# EasyEDA schematic SCH_krunchcard_2025-07-19.json
TITLE: Sheet_1; REV: 1.0; Date: 2024-11-27; Sheet: 1/1; Drawn By: krunchiekrunch; Company: Your Company
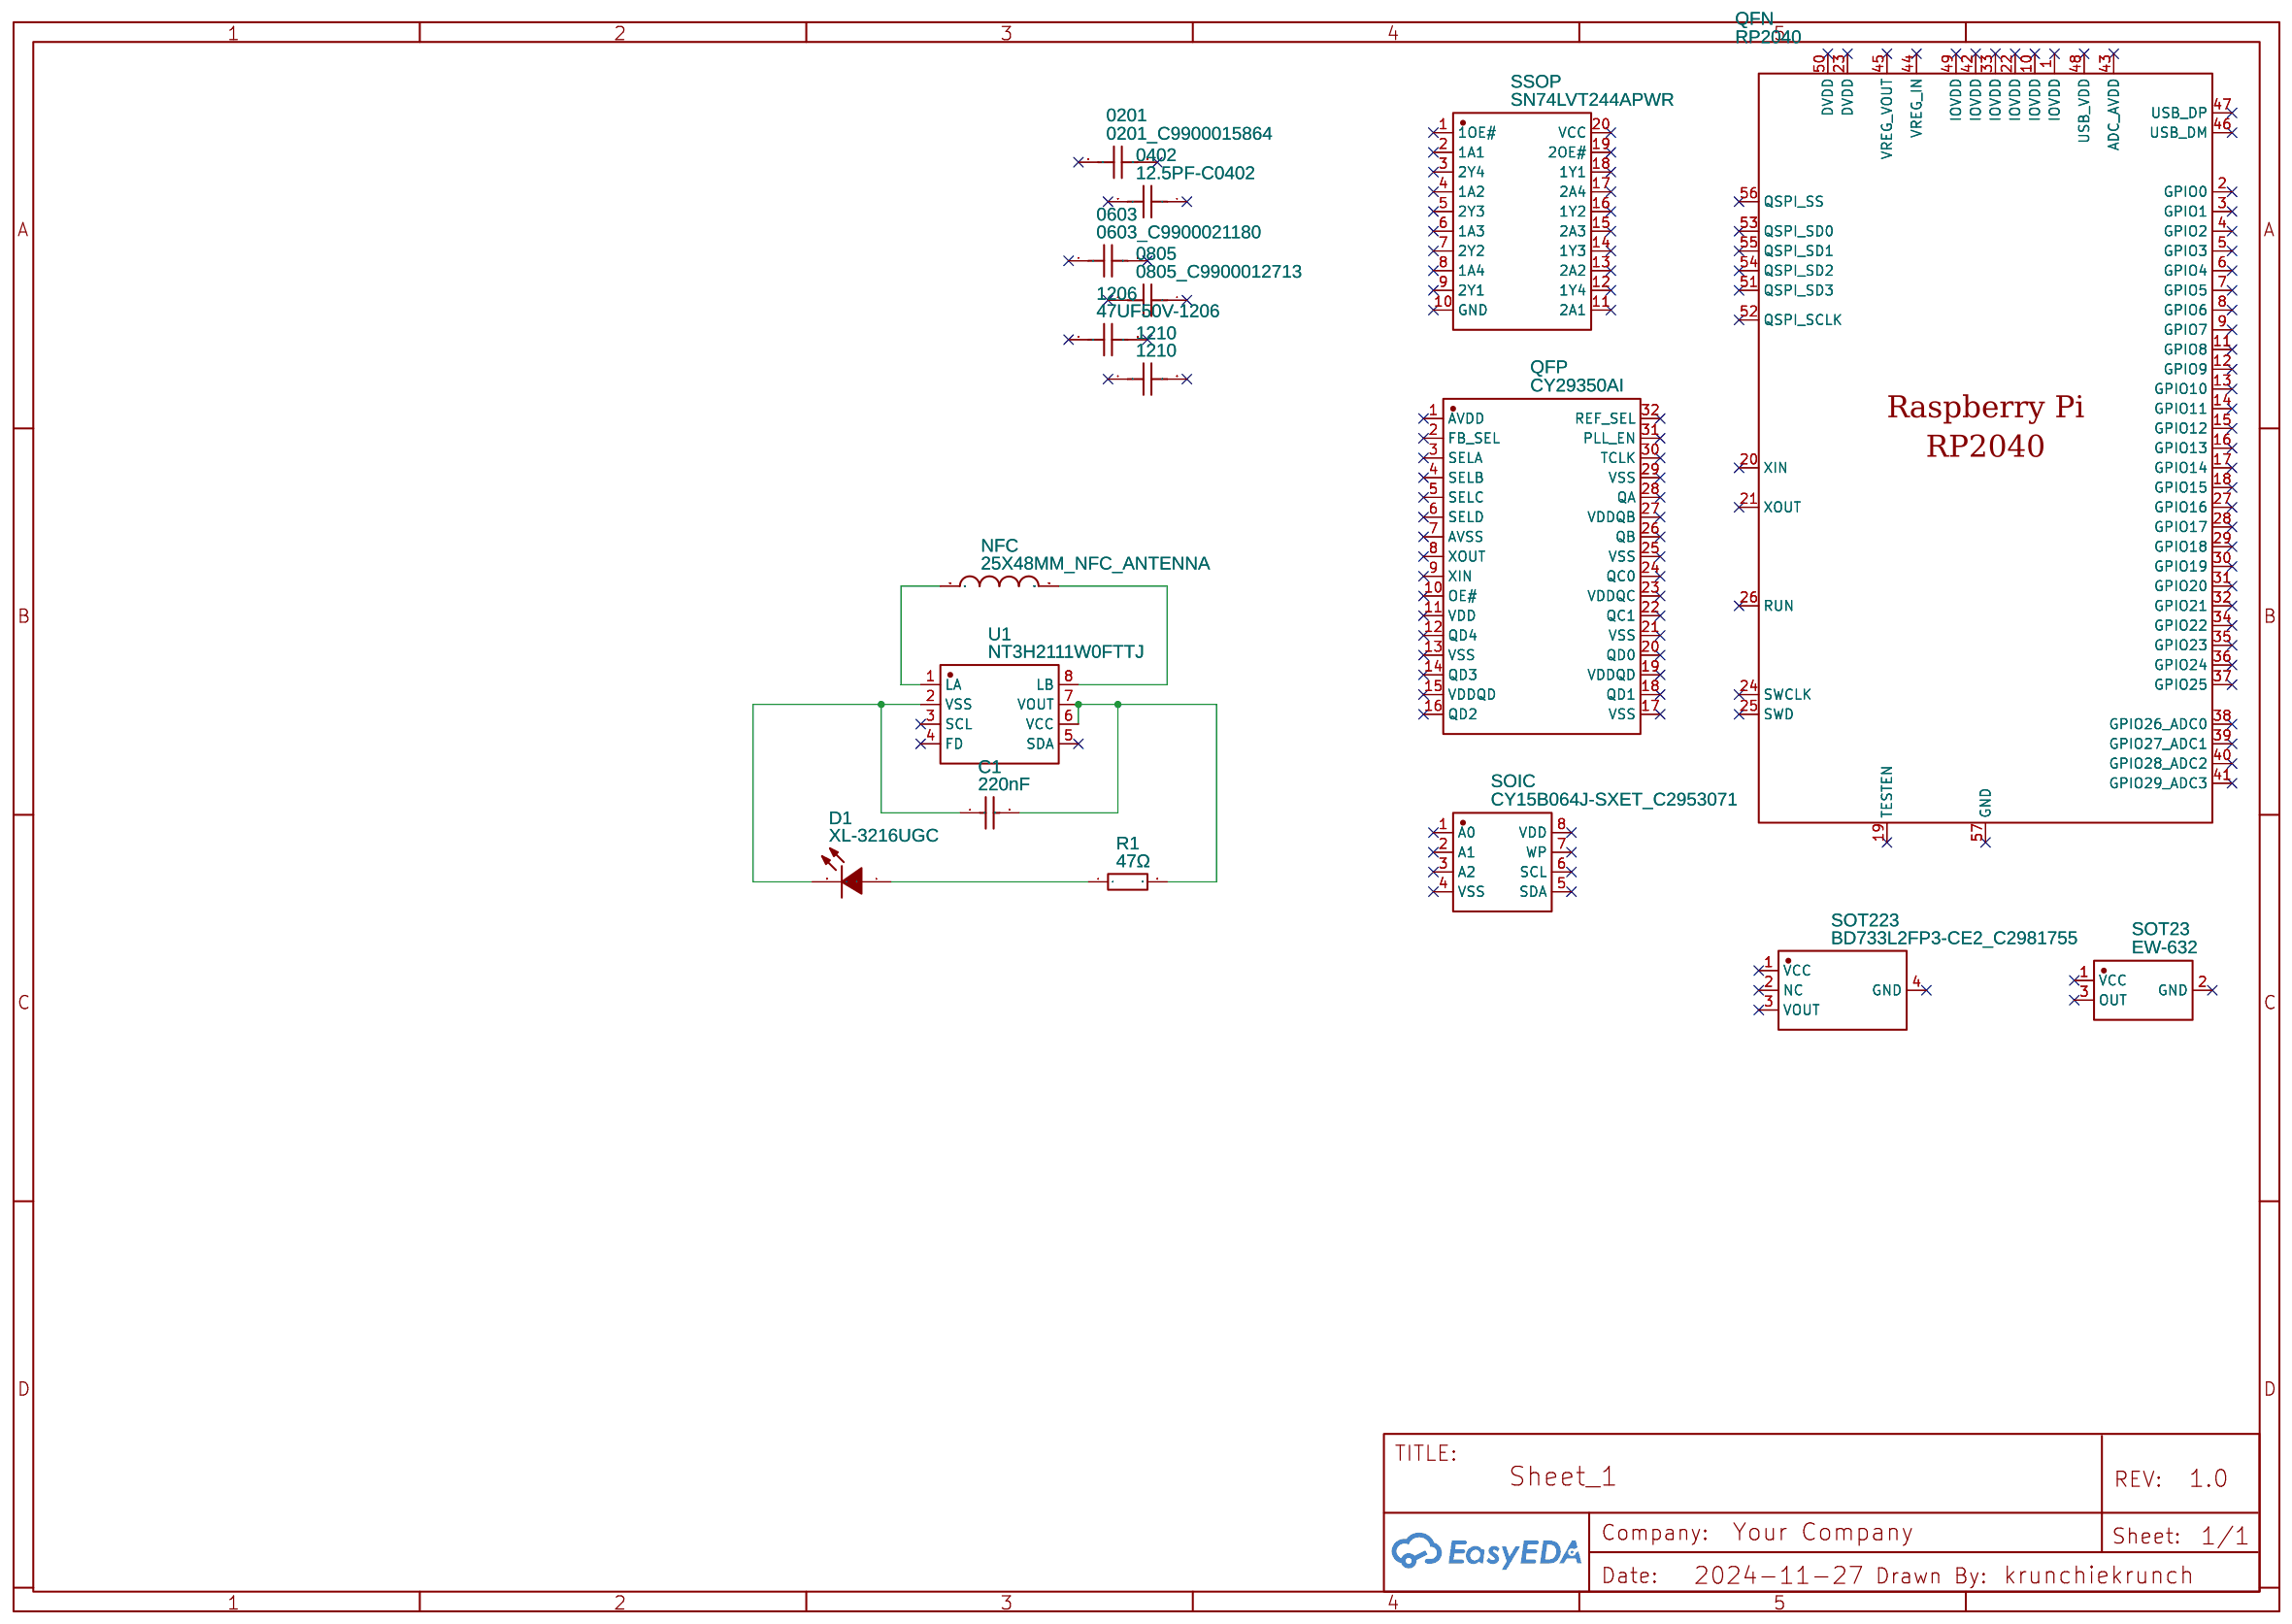
[diagram p0: schematic sheet]

## Parts
0201  0201_C9900015864  [C0201]
0402  12.5PF-C0402  [C0402]
0603  0603_C9900021180  [C0603]
0805  0805_C9900012713  [C0805]
1206  47UF50V-1206  [C1206]
1210  1210  [C1210]
C1  220nF  [C1206]
D1  XL-3216UGC  [LED1206-R-RD_GREEN]
NFC  25X48MM_NFC_ANTENNA  [25X48MM_NFC_ANTENNA]
QFN  RP2040  [LQFN-56_L7.0-W7.0-P0.4-EP]
QFP  CY29350AI  [TQFP-32_L7.0-W7.0-P0.80-LS9.0-TL]
R1  47Ω  [R1206]
SOIC  CY15B064J-SXET_C2953071  [SOIC-8_L4.9-W4.0-P1.27-LS6.0-BL]
SOT23  EW-632  [PG-SOT23-3_L3.0-W2.2-P1.90-LS3.1-BL]
SOT223  BD733L2FP3-CE2_C2981755  [PG-SOT223-4_L6.5-W3.5-P2.30-LS7.0-BR]
SSOP  SN74LVT244APWR  [TSSOP-20_L6.5-W4.4-P0.65-LS6.4-BL]
U1  NT3H2111W0FTTJ  [TSSOP-8_L3.0-W3.0-P0.65-LS4.9-BL]

## Library data of the parts
0201 = 0201_C9900015864: Contributor: lcsc; Supplier: LCSC; Supplier Part: C9900015864; Manufacturer: null; JLCPCB Part Class: Extended Part
0402 = 12.5PF-C0402: Contributor: lcsc; Supplier: LCSC; Supplier Part: C9900019607; Manufacturer: null; Manufacturer Part: 12.5pF-C0402; JLCPCB Part Class: Extended Part
0603 = 0603_C9900021180: Contributor: lcsc; Supplier: LCSC; Supplier Part: C9900021180; Manufacturer: null; JLCPCB Part Class: Extended Part
0805 = 0805_C9900012713: Contributor: LCSC; Supplier: LCSC; Supplier Part: C9900012713; Manufacturer: null; JLCPCB Part Class: Extended Part
1206 = 47UF50V-1206: Contributor: LCSC; Supplier: LCSC; Supplier Part: C2935720; Manufacturer: null; Manufacturer Part: 47uF50V-1206; JLCPCB Part Class: Extended Part
1210 = 1210: Contributor: lcsc; Supplier: LCSC; Supplier Part: C9900018278; Manufacturer: null; JLCPCB Part Class: Extended Part
C1 = CC1206KKX7R9BB224: Supplier: LCSC; Manufacturer: YAGEO(国巨); Supplier Part: C107186; JLCPCB Part Class: Extended Part
D1 = XL-3216UGC: Contributor: LCSC; Supplier: LCSC; Supplier Part: C965825; Manufacturer: XINGLIGHT(成兴光); JLCPCB Part Class: Extended Part
NFC = 25X48MM_NFC_ANTENNA: Contributor: LoneWalkerWolf
QFN = RP2040: Contributor: LCSC; Supplier: LCSC; Supplier Part: C2040; Manufacturer: Raspberry Pi(树莓派); JLCPCB Part Class: Extended Part
QFP = CY29350AI: Contributor: lcsc; Supplier: LCSC; Supplier Part: C2957055; Manufacturer: CYPRESS(赛普拉斯)
R1 = RS-06K470JT: Contributor: LCSC; Supplier: LCSC; Manufacturer: FH(风华); Supplier Part: C140015; JLCPCB Part Class: Extended Part
SOIC = CY15B064J-SXET_C2953071: Contributor: lcsc; Supplier: LCSC; Supplier Part: C2953071; Manufacturer: CYPRESS(赛普拉斯); Manufacturer Part: CY15B064J-SXET; JLCPCB Part Class: Extended Part
SOT23 = EW-632: Contributor: LCSC; Supplier: LCSC; Supplier Part: C2765042; Manufacturer: null; JLCPCB Part Class: Extended Part
SOT223 = BD733L2FP3-CE2_C2981755: Contributor: lcsc; Supplier: LCSC; Supplier Part: C2981755; Manufacturer: ROHM(罗姆); Manufacturer Part: BD733L2FP3-CE2; JLCPCB Part Class: Extended Part
SSOP = SN74LVT244APWR: Contributor: lcsc; Supplier: LCSC; Supplier Part: C3755078; Manufacturer: TI(德州仪器)
U1 = NT3H2111W0FTTJ: Contributor: LCSC; Supplier: LCSC; Supplier Part: C2654884; Manufacturer: NXP(恩智浦); JLCPCB Part Class: Extended Part

## Nets
Net-(C1-1): C1.1 D1.2(K) U1.2(VSS)
Net-(C1-2): C1.2 R1.2 U1.6(VCC) U1.7(VOUT)
Net-(D1-1): D1.1(A) R1.1
Net-(NFC-P$1): NFC.P$1 U1.1(LA)
Net-(NFC-P$2): NFC.P$2 U1.8(LB)

Not connected (* = marked no-connect by the designer): 0201 1* 2*; 0402 1* 2*; 0603 1* 2*; 0805 1* 2*; 1206 1* 2*; 1210 1* 2*; QFN 1(IOVDD)* 2(GPIO0)* 3(GPIO1)* 4(GPIO2)* 5(GPIO3)* 6(GPIO4)* 7(GPIO5)* 8(GPIO6)* 9(GPIO7)* 10(IOVDD)* 11(GPIO8)* 12(GPIO9)* 13(GPIO10)* 14(GPIO11)* 15(GPIO12)* 16(GPIO13)* 17(GPIO14)* 18(GPIO15)* 19(TESTEN)* 20(XIN)* 21(XOUT)* 22(IOVDD)* 23(DVDD)* 24(SWCLK)* 25(SWD)* 26(RUN)* 27(GPIO16)* 28(GPIO17)* 29(GPIO18)* 30(GPIO19)* 31(GPIO20)* 32(GPIO21)* 33(IOVDD)* 34(GPIO22)* 35(GPIO23)* 36(GPIO24)* 37(GPIO25)* 38(GPIO26_ADC0)* 39(GPIO27_ADC1)* 40(GPIO28_ADC2)* 41(GPIO29_ADC3)* 42(IOVDD)* 43(ADC_AVDD)* 44(VREG_IN)* 45(VREG_VOUT)* 46(USB_DM)* 47(USB_DP)* 48(USB_VDD)* 49(IOVDD)* 50(DVDD)* 51(QSPI_SD3)* 52(QSPI_SCLK)* 53(QSPI_SD0)* 54(QSPI_SD2)* 55(QSPI_SD1)* 56(QSPI_SS)* 57(GND)*; QFP 1(AVDD)* 2(FB_SEL)* 3(SELA)* 4(SELB)* 5(SELC)* 6(SELD)* 7(AVSS)* 8(XOUT)* 9(XIN)* 10(OE#)* 11(VDD)* 12(QD4)* 13(VSS)* 14(QD3)* 15(VDDQD)* 16(QD2)* 17(VSS)* 18(QD1)* 19(VDDQD)* 20(QD0)* 21(VSS)* 22(QC1)* 23(VDDQC)* 24(QC0)* 25(VSS)* 26(QB)* 27(VDDQB)* 28(QA)* 29(VSS)* 30(TCLK)* 31(PLL_EN)* 32(REF_SEL)*; SOIC 1(A0)* 2(A1)* 3(A2)* 4(VSS)* 5(SDA)* 6(SCL)* 7(WP)* 8(VDD)*; SOT23 1(VCC)* 2(GND)* 3(OUT)*; SOT223 1(VCC)* 2(NC)* 3(VOUT)* 4(GND)*; SSOP 1(1OE#)* 2(1A1)* 3(2Y4)* 4(1A2)* 5(2Y3)* 6(1A3)* 7(2Y2)* 8(1A4)* 9(2Y1)* 10(GND)* 11(2A1)* 12(1Y4)* 13(2A2)* 14(1Y3)* 15(2A3)* 16(1Y2)* 17(2A4)* 18(1Y1)* 19(2OE#)* 20(VCC)*; U1 3(SCL)* 4(FD)* 5(SDA)*
